# EAGLE design working (EAGLE 9.6.2)
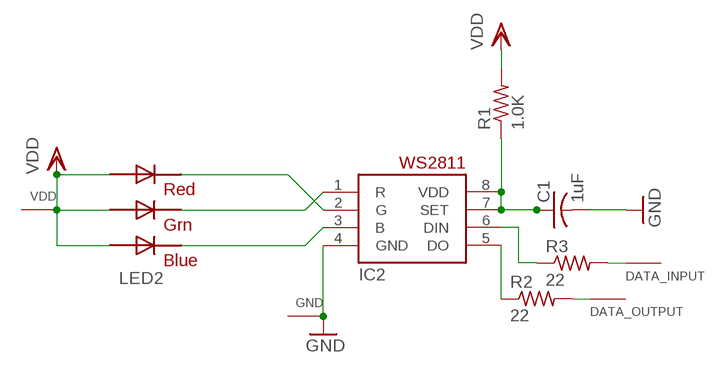
[diagram p0: schematic, sheet 1]

## Parts
C1  1uF  C-USC0805K  [C0805K]
DATA_INPUT  SEWTAP0.5IN  [SEWINGTAP_0.5]
DATA_OUTPUT  SEWTAP0.5IN  [SEWINGTAP_0.5]
GND  SEWTAP0.5IN  [SEWINGTAP_0.5]
IC2  WS2811-SOP8  [SO08-SKINNYPADS]
LED2  RGBLED5050  [RGBLED5050]
R1  1.0K  R-US_R0805  [R0805]
R2  22  R-US_R0805  [R0805]
R3  22  R-US_R0805  [R0805]
VDD  SEWTAP0.5IN  [SEWINGTAP_0.5]

## Nets
GND: C1.2 GND.TAP(SEW) IC2.4(GND)
N$1: IC2.3(B) LED2.4(BLUE_C)
N$2: IC2.2(G) LED2.5(RED_C)
N$3: IC2.1(R) LED2.6(GREEN_C)
N$4: IC2.6(DIN) R3.1
N$5: IC2.5(DO) R2.1
N$6: DATA_INPUT.TAP(SEW) R3.2
N$7: DATA_OUTPUT.TAP(SEW) R2.2
N$8: C1.1 IC2.7(SET) IC2.8(VDD) R1.1
VDD: LED2.1(GREEN_A) LED2.2(RED_A) LED2.3(BLUE_A) R1.2 VDD.TAP(SEW)

## Library data of the parts
C1 = adafruit:C-US: CAPACITOR, American symbol
DATA_INPUT DATA_OUTPUT GND VDD = adafruit:SEWTAP
IC2 = adafruit:WS2811
LED2 = adafruit:RGBLED: For 5050 RGB LEDs, the order of the LEDs may vary from one manufacturer to another!
R1-R3 = adafruit:R-US_: RESISTOR, American symbol

## Board
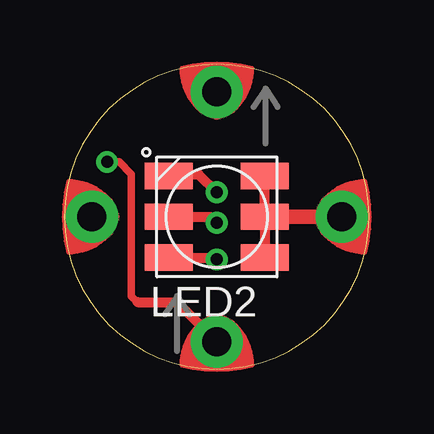
[diagram p1: board, top side]
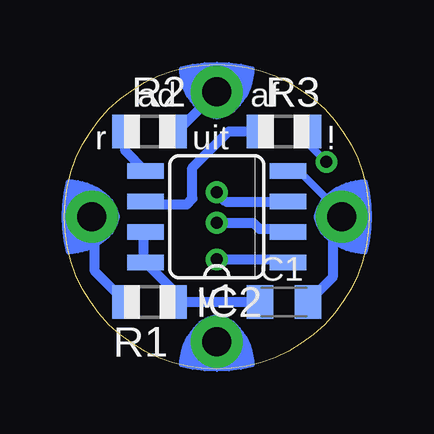
[diagram p2: board, bottom side, seen from below]

Size 12.7 x 12.7 mm. Coordinates in mm from the lower left corner, seen from the top.
Outline: 6.35,0 arc90 12.7,6.35 arc90 6.35,12.7 arc90 0,6.35 arc90 6.35,0
Copper layers (1*16): Top 0.035mm / dielectric 1.5mm / Bottom 0.035mm
Design rules "default *": minimum track width 10mil, minimum drill 19mil, track to track 10mil, track to pad 10mil, pad to pad 10mil, via to via 10mil, smd to smd 0mil, copper to edge 0mil, drill to drill 8mil, minimum pad ring 10mil, minimum via ring 8mil, stop-mask expansion 4mil, vias tented up to drill 20mil, thermal gap 10mil

### Footprints (pad centres in the part's own frame; a part is rotated, then mirrored left to right if it is on the bottom)
C0805K = smd 1.1 x 1.4: 1 -1,0; 2 1,0
SEWINGTAP_0.5 = drill 1.2 pad 2.184: TAP 0,0
SO08-SKINNYPADS = smd 0.66 x 1.524: 1 -1.905,-2.973; 2 -0.635,-2.973; 3 0.635,-2.973; 4 1.905,-2.973; 5 1.905,2.973; 6 0.635,2.973; 7 -0.635,2.973; 8 -1.905,2.973
RGBLED5050 = smd 2 x 1.1: 1 -2,1.7; 2 -2,0; 3 -2,-1.7; 4 2,-1.7; 5 2,0; 6 2,1.7
R0805 = smd 1.1 x 1.4: 1 -1,0; 2 1,0

### Placement (x,y rotation side)
C1  3.56,2.79 0 bottom
DATA_INPUT  6.35,1.14 180 top
DATA_OUTPUT  6.35,11.56 0 top
GND  1.14,6.35 90 top
IC2  6.35,6.35 90 bottom
LED2  6.35,6.35 180 top
R1  9.14,2.79 180 bottom
R2  9.14,9.91 0 bottom
R3  3.56,9.91 0 bottom
VDD  11.56,6.35 270 top

### Tracks (layer width: path | path; a pad name or v marks a point on that pad's centre or on a via)
GND
  Bottom 0.305: IC2.4 2.92,8.25 1.14,6.48
  Bottom 0.406: C1.2 1.52,3.83 1.52,6.1 1.4,6.1 GND.TAP 1.14,6.48 1.02,6.6
N$1  (via drill 0.5)
  Top 0.406: LED2.4 4.32,8.08 4.32,8.13 5.59,8.13 v6.35,7.37
  Bottom 0.406: IC2.3 5.97,6.98 v6.35,7.37
N$2  (via drill 0.5)
  Top 0.406: LED2.5 6.1,6.35 v6.35,6.1
  Bottom 0.406: v6.35,6.1 4.83,6.1 4.57,5.84 3.3,5.84 3.38,5.77 IC2.2
N$3  (via drill 0.5)
  Top 0.406: LED2.6 6.27,4.65 v6.35,4.57
  Bottom 0.406: IC2.1 3.38,4.5 3.3,4.57 v6.35,4.57
N$4
  Bottom 0.406: R3.1 5.84,9.91 7.37,8.38 7.37,7.11 7.62,6.86 9.2,6.86 IC2.6
N$5
  Bottom 0.406: R2.1 10.16,9.91 10.16,9.09 IC2.5
N$6  (via drill 0.5)
  Top 0.305: 3.05,2.79 2.79,3.05 2.79,8.13 2.29,8.64 v1.78,8.64
  Top 0.406: DATA_INPUT.TAP 4.7,2.79 3.05,2.79
  Bottom 0.305: R3.2 2.54,9.91 2.54,9.4 v1.78,8.64
N$7
  Bottom 0.406: DATA_OUTPUT.TAP 8,9.91 R2.2
N$8
  Bottom 0.406: IC2.7 9.4,5.71 9.4,4.44 IC2.8 8.13,3.25 8.13,2.81 R1.1 C1.1
VDD
  Top 0.406: VDD.TAP 11.3,6.35 | LED2.2 LED2.1 | LED2.2 8.35,6.44 8.38,6.48 | LED2.3 8.35,7.91 8.38,7.87 8.35,7.84 LED2.2
  Top 0.61: 11.3,6.35 LED2.2
  Bottom 0.406: VDD.TAP 11.43,6.35 11.43,4.08 R1.2

### Text on the board
bPlace: af | ad | ! | uit | r | v1
tDocu: - | +